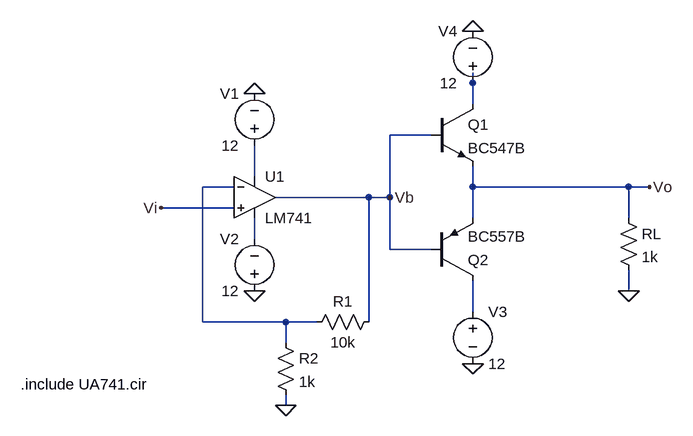
[diagram p0: schematic (b).asc]
(b).asc, the LTspice schematic file:
Version 4
SHEET 1 880 680
WIRE 384 -48 384 -64
WIRE 384 -16 384 -48
WIRE 320 32 256 32
WIRE 48 96 48 48
WIRE 16 112 -32 112
WIRE 384 112 384 80
WIRE 624 112 384 112
WIRE 656 112 624 112
WIRE 224 128 80 128
WIRE 256 128 256 32
WIRE 256 128 224 128
WIRE 16 144 -96 144
WIRE 384 160 384 112
WIRE 624 160 624 112
WIRE 48 192 48 160
WIRE 256 208 256 128
WIRE 320 208 256 208
WIRE 624 272 624 240
WIRE 384 304 384 256
WIRE -32 320 -32 112
WIRE 96 320 -32 320
WIRE 144 320 96 320
WIRE 224 320 224 128
WIRE 96 352 96 320
WIRE 96 448 96 432
FLAG 48 -32 0
FLAG 48 272 0
FLAG 96 448 0
FLAG 384 -128 0
FLAG 384 384 0
FLAG -96 144 Vi
FLAG 656 112 Vo
FLAG 256 128 Vb
FLAG 624 272 0
SYMBOL OpAmps\\opamp2 48 64 R0
SYMATTR InstName U1
SYMATTR Value LM741
SYMBOL voltage 48 64 R180
WINDOW 0 24 96 Left 2
WINDOW 3 24 16 Left 2
WINDOW 123 0 0 Left 0
WINDOW 39 0 0 Left 0
SYMATTR InstName V1
SYMATTR Value 12
SYMBOL voltage 48 288 R180
WINDOW 0 24 96 Left 2
WINDOW 3 24 16 Left 2
WINDOW 123 0 0 Left 0
WINDOW 39 0 0 Left 0
SYMATTR InstName V2
SYMATTR Value 12
SYMBOL npn 320 -16 R0
SYMATTR InstName Q1
SYMATTR Value BC547B
SYMBOL pnp 320 256 M180
SYMATTR InstName Q2
SYMATTR Value BC557B
SYMBOL res 240 304 R90
WINDOW 0 0 56 VBottom 2
WINDOW 3 32 56 VTop 2
SYMATTR InstName R1
SYMATTR Value 10k
SYMBOL res 80 336 R0
SYMATTR InstName R2
SYMATTR Value 1k
SYMBOL voltage 384 288 R0
WINDOW 123 0 0 Left 0
WINDOW 39 0 0 Left 0
SYMATTR InstName V3
SYMATTR Value 12
SYMBOL voltage 384 -32 R180
WINDOW 0 24 96 Left 2
WINDOW 3 24 16 Left 2
WINDOW 123 0 0 Left 0
WINDOW 39 0 0 Left 0
SYMATTR InstName V4
SYMATTR Value 12
SYMBOL res 608 144 R0
SYMATTR InstName RL
SYMATTR Value 1k
TEXT -312 416 Left 2 !.include UA741.cir

The netlist it stands for:
* (b).asc
XU1 Vi N003 N002 N004 Vb LM741  ; pins In+ In- V+ V- OUT
V1 N002 0 12
V2 0 N004 12
Q1 N001 Vb Vo 0 BC547B
Q2 N005 Vb Vo 0 BC557B
R1 Vb N003 10k
R2 N003 0 1k
V3 N005 0 12
V4 N001 0 12
RL Vo 0 1k
.model NPN NPN
.model PNP PNP
.lib standard.bjt
.include UA741.cir
.backanno
.end